# Altium schematic sheet 18_Type_C.SchDoc
size 420 x 297 mm
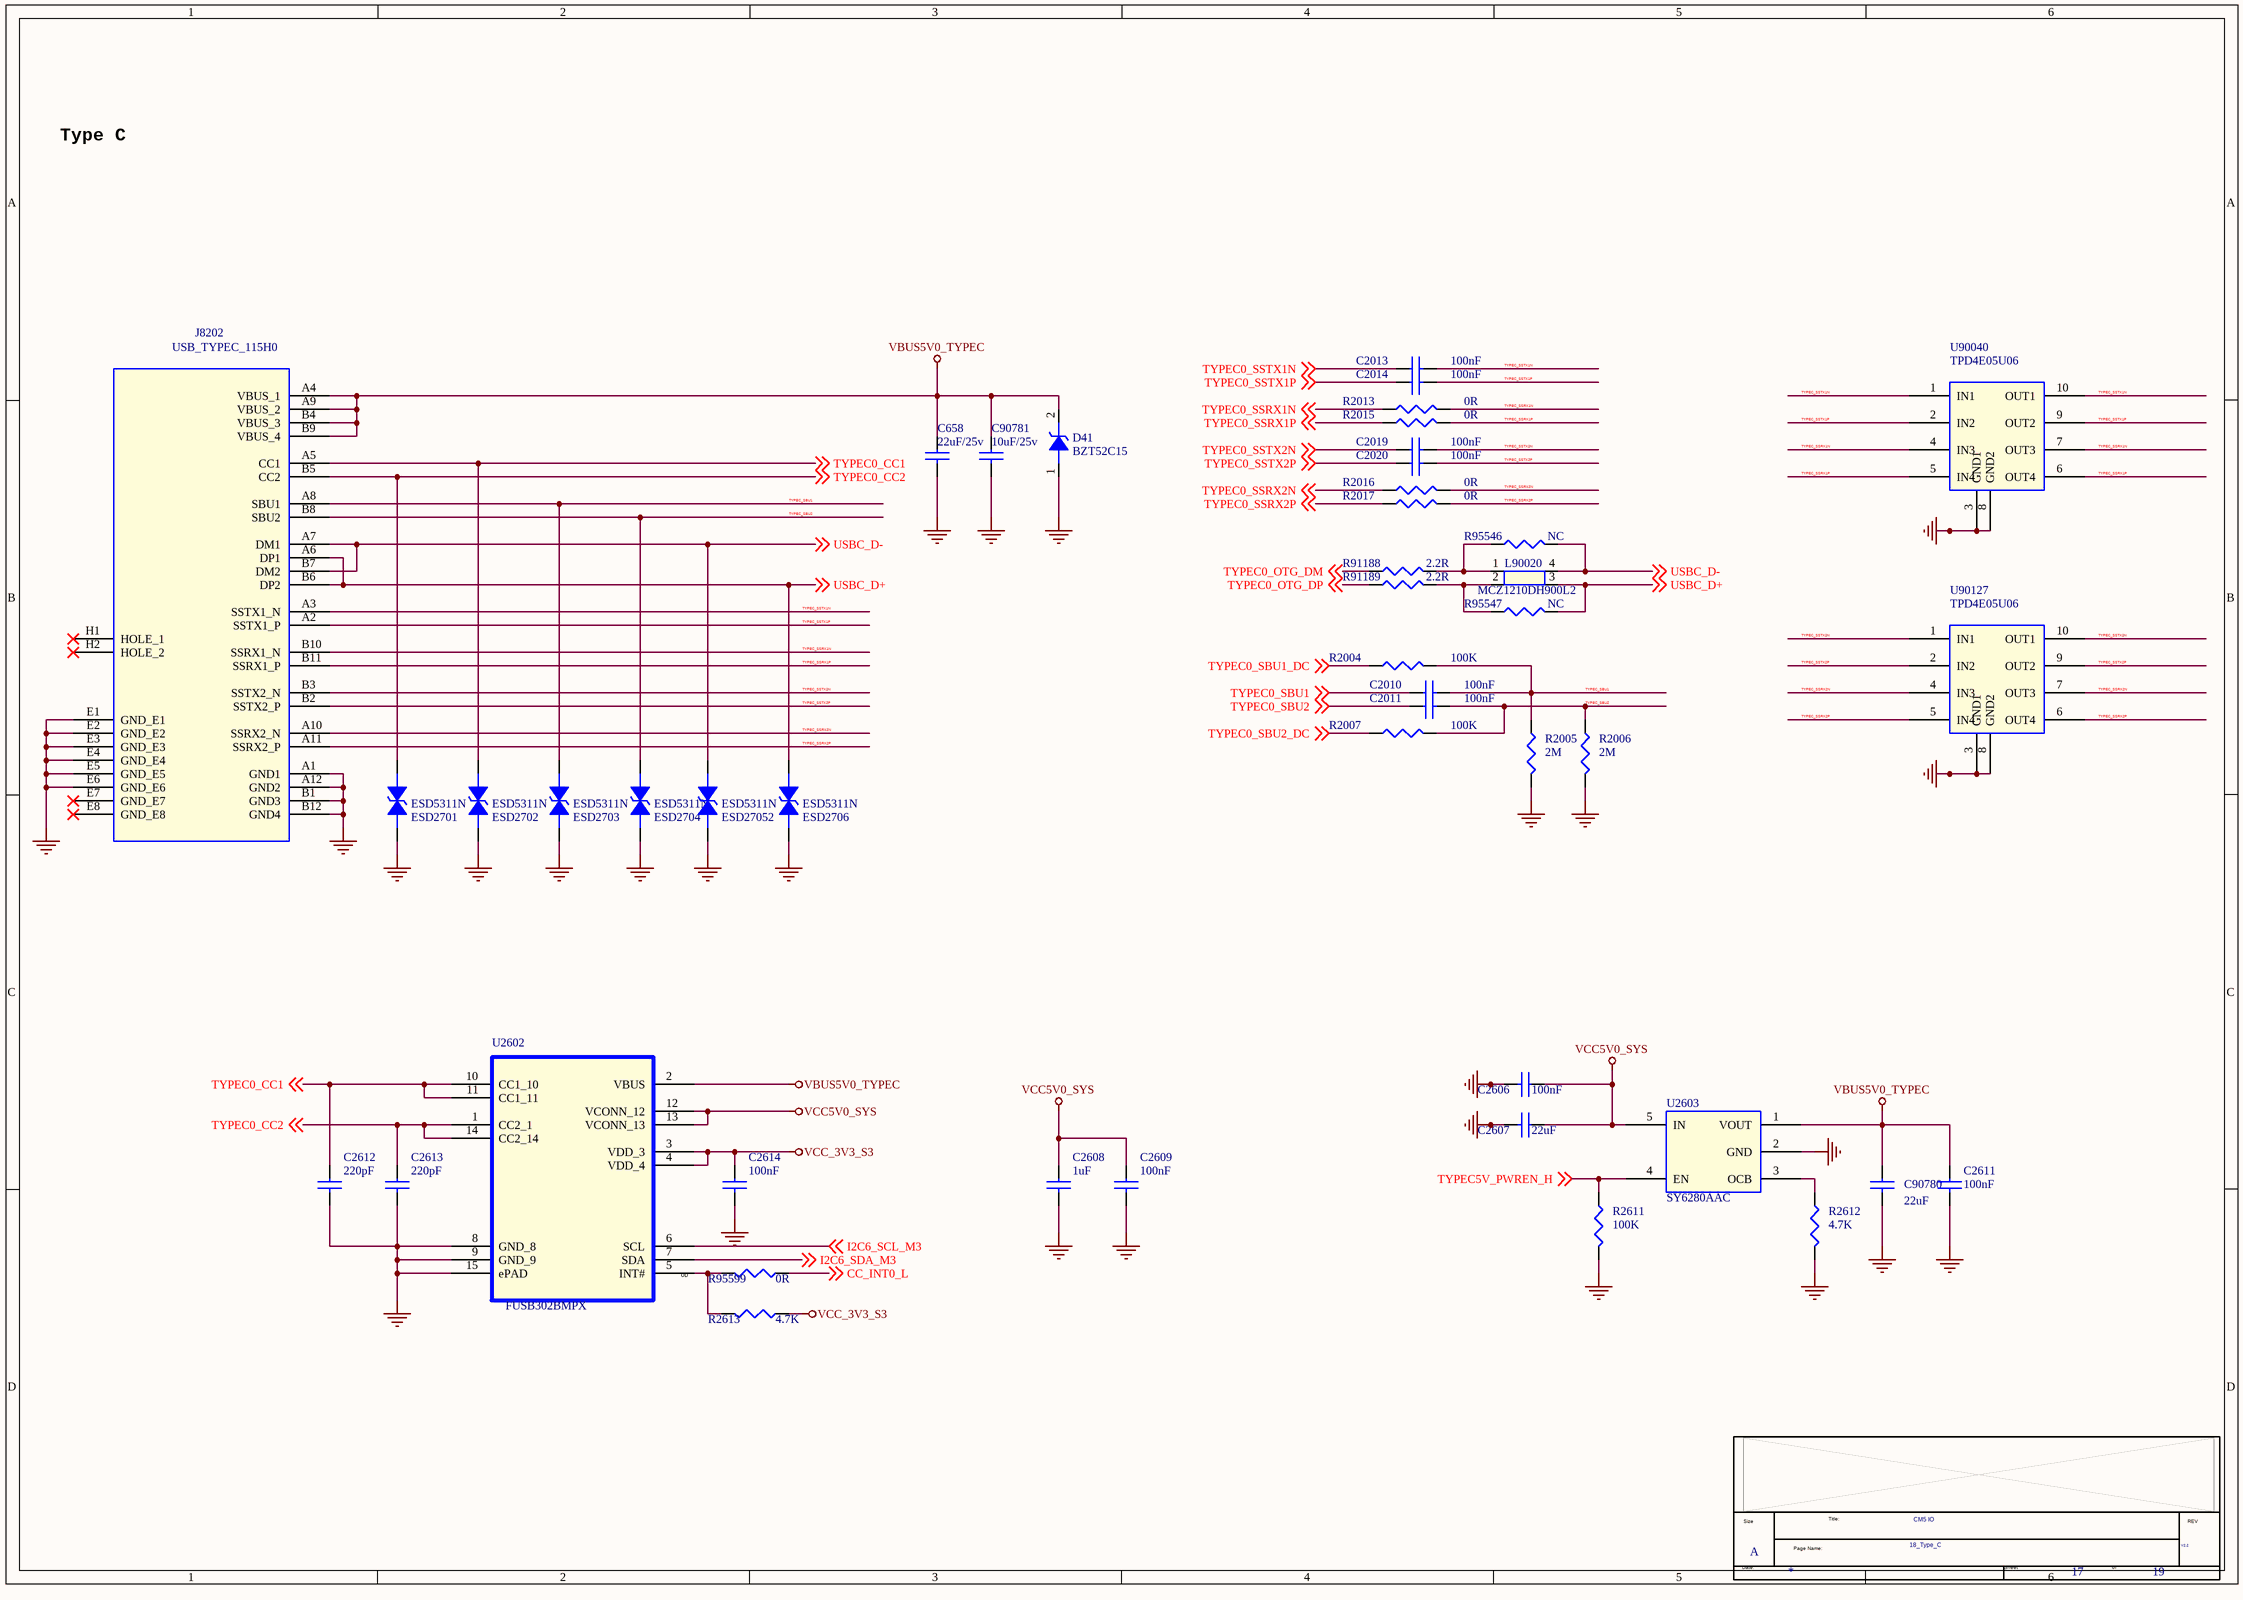
[diagram p0: 18_Type_C.SchDoc]

## Parts
*  Doc: 18_Type_C  RevCode: V2.2  Title: CM5 IO  Page Size: A  Page Number: 17  Page Count: 19  (hidden comment: radxa_1010)  (graphical)
C658  22uF/25v  [C0201]
C2010  100nF  [C0201]
C2011  100nF  [C0201]
C2013  100nF  [C0201]
C2014  100nF  [C0201]
C2019  100nF  [C0201]
C2020  100nF  [C0201]
C2606  100nF  [C0402]
C2607  22uF  [C0603]
C2608  1uF  [C0402]
C2609  100nF  [C0402]
C2611  100nF  [C0402]
C2612  220pF  [C0402]
C2613  220pF  [C0402]
C2614  100nF  [C0402]
C90780  22uF  [C0805]
C90781  10uF/25v  [C0201]
D41  BZT52C15  [SOD_123]
ESD2701  ESD5311N  [ESD0402]
ESD2702  ESD5311N  [ESD0402]
ESD2703  ESD5311N  [ESD0402]
ESD2704  ESD5311N  [ESD0402]
ESD2706  ESD5311N  [ESD0402]
ESD27052  ESD5311N  [ESD0402]
J8202  USB_TYPEC_115H0  [TYPEC-24PIN-SMD-OK]
L90020  MCZ1210DH900L2  [MCZ1210AH900L2]
R2004  100K  [R0402]
R2005  2M  [R0402]
R2006  2M  [R0402]
R2007  100K  [R0402]
R2013  0R  [R0402]
R2015  0R  [R0402]
R2016  0R  [R0402]
R2017  0R  [R0402]
R2611  100K  [R0402]
R2612  4.7K  [R0402]
R2613  4.7K  [R0402]
R91188  2.2R  [R0402]
R91189  2.2R  [R0402]
R95546  NC  [R0402]
R95547  NC  [R0402]
R95599  0R  [R0402]
U2602  FUSB302BMPX  [MLP14_2R50X2R50X0R80]
U2603  SY6280AAC  [SOT_23_5]
U90040  TPD4E05U06  [SON10_2R50X1R00X0R50]
U90127  TPD4E05U06  [SON10_2R50X1R00X0R50]

## Nets
GND: C658.2 C2606.2 C2607.2 C2608.2 C2609.2 C2611.2 C2612.2 C2613.2 C2614.2 C90780.2 C90781.2 D41.1(ANODE) ESD2701.2 ESD2702.2 ESD2703.2 ESD2704.2 ESD2706.2 ESD27052.2 J8202.A1(GND1) J8202.A12(GND2) J8202.B1(GND3) J8202.B12(GND4) J8202.E1(GND_E1) J8202.E2(GND_E2) J8202.E3(GND_E3) J8202.E4(GND_E4) J8202.E5(GND_E5) J8202.E6(GND_E6) R2005.2 R2006.2 R2611.2 R2612.2 U2602.8(GND_8) U2602.9(GND_9) U2602.15(ePAD) U2603.2(GND) U90040.3(GND1) U90040.8(GND2) U90127.3(GND1) U90127.8(GND2)
VBUS5V0_TYPEC: C658.1 C2611.1 C90780.1 C90781.1 D41.2(CATHODE) J8202.A4(VBUS_1) J8202.A9(VBUS_2) J8202.B4(VBUS_3) J8202.B9(VBUS_4) U2602.2(VBUS) U2603.1(VOUT)
VCC5V0_SYS: C2606.1 C2607.1 C2608.1 C2609.1 U2602.12(VCONN_12) U2602.13(VCONN_13) U2603.5(IN)
VCC_3V3_S3: C2614.1 R2613.1 U2602.3(VDD_3) U2602.4(VDD_4)
CC_INT0_L: R95599.1 ; off-sheet CC_INT0_L
I2C6_SCL_M3: U2602.6(SCL) ; off-sheet I2C6_SCL_M3
I2C6_SDA_M3: U2602.7(SDA) ; off-sheet I2C6_SDA_M3
TYPEC0_CC1: C2612.1 ESD2702.1 J8202.A5(CC1) U2602.10(CC1_10) U2602.11(CC1_11) ; off-sheet TYPEC0_CC1
TYPEC0_CC2: C2613.1 ESD2701.1 J8202.B5(CC2) U2602.1(CC2_1) U2602.14(CC2_14) ; off-sheet TYPEC0_CC2
TYPEC0_OTG_DM: R91188.1 ; off-sheet TYPEC0_OTG_DM
TYPEC0_OTG_DP: R91189.1 ; off-sheet TYPEC0_OTG_DP
TYPEC0_SBU1: C2010.1 ; off-sheet TYPEC0_SBU1
TYPEC0_SBU1_DC: R2004.1 ; off-sheet TYPEC0_SBU1_DC
TYPEC0_SBU2: C2011.1 ; off-sheet TYPEC0_SBU2
TYPEC0_SBU2_DC: R2007.1 ; off-sheet TYPEC0_SBU2_DC
TYPEC0_SSRX1N: R2013.1 ; off-sheet TYPEC0_SSRX1N
TYPEC0_SSRX1P: R2015.1 ; off-sheet TYPEC0_SSRX1P
TYPEC0_SSRX2N: R2016.1 ; off-sheet TYPEC0_SSRX2N
TYPEC0_SSRX2P: R2017.1 ; off-sheet TYPEC0_SSRX2P
TYPEC0_SSTX1N: C2013.1 ; off-sheet TYPEC0_SSTX1N
TYPEC0_SSTX1P: C2014.1 ; off-sheet TYPEC0_SSTX1P
TYPEC0_SSTX2N: C2019.1 ; off-sheet TYPEC0_SSTX2N
TYPEC0_SSTX2P: C2020.1 ; off-sheet TYPEC0_SSTX2P
TYPEC5V_PWREN_H: R2611.1 U2603.4(EN) ; off-sheet TYPEC5V_PWREN_H
TYPEC_SBU1: C2010.2 ESD2703.1 J8202.A8(SBU1) R2004.2 R2005.1
TYPEC_SBU2: C2011.2 ESD2704.1 J8202.B8(SBU2) R2006.1 R2007.2
TYPEC_SSRX1N: J8202.B10(SSRX1_N) R2013.2 U90040.4(IN3) U90040.7(OUT3)
TYPEC_SSRX1P: J8202.B11(SSRX1_P) R2015.2 U90040.5(IN4) U90040.6(OUT4)
TYPEC_SSRX2N: J8202.A10(SSRX2_N) R2016.2 U90127.4(IN3) U90127.7(OUT3)
TYPEC_SSRX2P: J8202.A11(SSRX2_P) R2017.2 U90127.5(IN4) U90127.6(OUT4)
TYPEC_SSTX1N: C2013.2 J8202.A3(SSTX1_N) U90040.1(IN1) U90040.10(OUT1)
TYPEC_SSTX1P: C2014.2 J8202.A2(SSTX1_P) U90040.2(IN2) U90040.9(OUT2)
TYPEC_SSTX2N: C2019.2 J8202.B3(SSTX2_N) U90127.1(IN1) U90127.10(OUT1)
TYPEC_SSTX2P: C2020.2 J8202.B2(SSTX2_P) U90127.2(IN2) U90127.9(OUT2)
USBC_D+: ESD2706.1 J8202.A6(DP1) J8202.B6(DP2) L90020.3 R95547.2 ; off-sheet USBC_D+
USBC_D-: ESD27052.1 J8202.A7(DM1) J8202.B7(DM2) L90020.4 R95546.2 ; off-sheet USBC_D-
NetL90020_1: L90020.1 R91188.2 R95546.1
NetL90020_2: L90020.2 R91189.2 R95547.1
NetR2612_1: R2612.1 U2603.3(OCB)
NetR2613_2: R2613.2 R95599.2 U2602.5(INT#)

Not connected (* = marked no-connect by the designer): J8202 E7(GND_E7)* E8(GND_E8)* H1(HOLE_1)* H2(HOLE_2)*

## Notes on the sheet
- Type C
- (near U2602) OD
- (in symbol radxa_1010) Size; Title:; REV; Page Name:; Date:; Sheet; of

## Library data of the parts
C658 = C / 100 / nF / 0201_6: 0201 ∮ 10% 100nf X5R 6.3V; FS: Y; Property1: ∮ 10%; FPLIST: C0201,M0201; FunctionGroup: Petrus / BB; PCB Footprint: C0805; Property3: 6.3V; Property2: X5R
C2010 C2011 C2013 C2014 C2019 C2020 = CAP NP_0: cap,100.00nF,+/-10%,10V,X5R,C0201; Manufacturer: TDK; RK PN: C0603X5R1A104K030BC; Priority: A; Tolerance: 10%; Voltage: 10V; PCB Footprint: C0201; Dielectric: X5R; Part Type: C0201; Manufacturer PN: C0603X5R1A104K030BC; Created by: JJJ
C2606 = CAP NP_0: cap,100.00nF,+/-10%,16V,X5R,C0402; Manufacturer PN: C1005X5R1C104K050BA; Manufacturer: TDK; Tolerance: 10%; C_Voltage: 6.3V; Priority: A; Voltage: 16V; PCB Footprint: C0402; Dielectric: X5R; Created by: JJJ; Part Type: C0402; RK PN: C1005X5R1C104K050BA
C2607 = CAP NP_0: cap,22.00uF,+/-20%,10V,X5R,C0603; Manufacturer PN: C1608X5R1A226M080AC; Manufacturer: TDK; Tolerance: 20%; C_Voltage: 6.3V; Priority: A; Voltage: 10V; PCB Footprint: C0603; Dielectric: X5R; Created by: JJJ; Part Type: C0603; RK PN: C1608X5R1A226M080AC
C2608 = CAP NP_0: cap,1.00uF,+/-10%,16V,X5R,C0402; Manufacturer: TDK; RK PN: C1005X5R1C105K050BC; Priority: A; Tolerance: 10%; Voltage: 16V; PCB Footprint: C0402; Dielectric: X5R; Part Type: C0402; Manufacturer PN: C1005X5R1C105K050BC; Created by: JJJ
C2609 = CAP NP_0: cap,100.00nF,+/-10%,16V,X5R,C0402; Manufacturer PN: C1005X5R1C104K050BA; Manufacturer: TDK; Tolerance: 10%; Priority: A; Voltage: 16V; PCB Footprint: C0402; Dielectric: X5R; Created by: JJJ; Part Type: C0402; RK PN: C1005X5R1C104K050BA
C2611 = CAP NP_0: cap,100.00nF,+/-10%,16V,X5R,C0402; Manufacturer: TDK; Voltage: 25V; RK PN: C1005X5R1C104K050BA; Priority: A; Tolerance: 10%; PCB Footprint: C0402; Dielectric: X5R; Part Type: C0402; Manufacturer PN: C1005X5R1C104K050BA; Created by: JJJ
C2612 = CAP NP_0: cap,220.00pF,+/-5%,50V,C0G,C0402; Manufacturer PN: C1005C0G1H221J050BA; Manufacturer: TDK; Tolerance: 5%; Priority: A; Voltage: 50V; PCB Footprint: C0402; Dielectric: C0G; Created by: JJJ; Part Type: C0402; RK PN: C1005C0G1H221J050BA
C2613 = CAP NP_0: cap,220.00pF,+/-5%,50V,C0G,C0402; Manufacturer: TDK; RK PN: C1005C0G1H221J050BA; Priority: A; Tolerance: 5%; Voltage: 50V; PCB Footprint: C0402; Dielectric: C0G; Part Type: C0402; Manufacturer PN: C1005C0G1H221J050BA; Created by: JJJ
C2614 = CAP NP_0: cap,100.00nF,+/-10%,16V,X5R,C0402; Manufacturer: TDK; RK PN: C1005X5R1C104K050BA; Priority: A; Tolerance: 10%; Voltage: 16V; PCB Footprint: C0402; Dielectric: X5R; Part Type: C0402; Manufacturer PN: C1005X5R1C104K050BA; Created by: JJJ
C90780 = CAP NP_0: cap,22.00uF,+/-20%,10V,X5R,C0603; Manufacturer: TDK; Voltage: 25V; RK PN: C1608X5R1A226M080AC; Priority: A; C_Voltage: 6.3V; Tolerance: 20%; PCB Footprint: C0805; Dielectric: X5R; Part Type: C0603; Manufacturer PN: C1608X5R1A226M080AC; Created by: JJJ
C90781 = C / 100 / nF / 0201_6: 0201 ∮ 10% 100nf X5R 6.3V; FunctionGroup: Petrus / BB; FPLIST: C0201,M0201; Property1: ∮ 10%; FS: Y; PCB Footprint: C0805; Property2: X5R; Property3: 6.3V
D41 = DIODE ZENER1_0: ZENER DIODE,Vz=3.3V,BZT52C3V3,SOD-123; Manufacturer: 长电; Priority: A; PCB Footprint: SOD_123; RK PN: BZT52C3V3; Part Type: Zener Diodes; Manufacturer PN: BZT52C3V3; Created by: JJJ
ESD2701 = DIODE BI_DIR TRIG_1_Dup1: 1-Line, Bi-directional, Transient Voltage Suppressors.1pF.; Manufacturer: WillSemi(韦尔半导体); Manufacturer PN: ESD5341N; Priority: A; PCB Footprint: ESD0402; Created by: JJJ; Part Type: ESD_TVS; RK PN: ESD5341N
ESD2702-ESD2704 ESD2706 ESD27052 = DIODE BI_DIR TRIG_1_Dup1: 1-Line, Bi-directional, Transient Voltage Suppressors.1pF.; Manufacturer: WillSemi(韦尔半导体); RK PN: ESD5341N; Priority: A; PCB Footprint: ESD0402; Part Type: ESD_TVS; Manufacturer PN: ESD5341N; Created by: JJJ
J8202 = USB31_TYPE_C: USB Type-C 连接座; Manufacturer: 泰科; Priority: A; PCB Footprint: TYPEC-24PIN-SMD-OK; RK PN: USB_TYPEC_115H0; Part Type: USB Jack; Manufacturer Part Number: USB_TYPEC_115H0; Created by: JJJ
L90020 = MCZ1210AH900L2_1_Dup1: PCB Footprint: MCZ1210AH900L2
R2004 = RESISTOR_1: 通用厚膜电阻,100K,+/-5%,R0201,1/20W.; Manufacturer: YAGEO; Tolerance: 5%; RK PN: RC0201JR-07100KL; Priority: A; Wattage: 1/20W; PCB Footprint: R0201; Part Type: 通用厚膜电阻; Manufacturer PN: RC0201JR-07100KL; Created by: YTL
R2005 = RESISTOR_1: 通用厚膜电阻,2M,+/-5%,R0201,1/20W.; Manufacturer PN: RC0201JR-072ML; Manufacturer: YAGEO; Tolerance: 5%; OPTION: DNP; Wattage: 1/20W; Priority: A; PCB Footprint: R0201; Created by: YTL; Part Type: 通用厚膜电阻; RK PN: RC0201JR-072ML
R2006 = RESISTOR_1: 通用厚膜电阻,2M,+/-5%,R0201,1/20W.; Manufacturer: YAGEO; Tolerance: 5%; OPTION: DNP; RK PN: RC0201JR-072ML; Priority: A; Wattage: 1/20W; PCB Footprint: R0201; Part Type: 通用厚膜电阻; Manufacturer PN: RC0201JR-072ML; Created by: YTL
R2007 = RESISTOR_1: 通用厚膜电阻,100K,+/-5%,R0201,1/20W.; Manufacturer PN: RC0201JR-07100KL; Manufacturer: YAGEO; Tolerance: 5%; Wattage: 1/20W; Priority: A; PCB Footprint: R0201; Created by: YTL; Part Type: 通用厚膜电阻; RK PN: RC0201JR-07100KL
R2013 R2015 R2016 = RESISTOR_1: 通用厚膜电阻,0R,+/-5%,R0201,1/20W.; Manufacturer PN: RC0201JR-070RL; Manufacturer: YAGEO; Tolerance: 5%; Wattage: 1/20W; Priority: A; PCB Footprint: R0201; Created by: YTL; Part Type: 通用厚膜电阻; RK PN: RC0201JR-070RL
R2017 = RESISTOR_1: 通用厚膜电阻,0R,+/-5%,R0201,1/20W.; Manufacturer: YAGEO; Tolerance: 5%; RK PN: RC0201JR-070RL; Priority: A; Wattage: 1/20W; PCB Footprint: R0201; Part Type: 通用厚膜电阻; Manufacturer PN: RC0201JR-070RL; Created by: YTL
R2611 = RESISTOR_1: 通用厚膜电阻,100K,+/-5%,R0402,1/16W.; Manufacturer: YAGEO; Tolerance: 5%; RK PN: RC0402JR-07100KL; Priority: A; Wattage: 1/16W; PCB Footprint: R0402; Part Type: 通用厚膜电阻; Manufacturer PN: RC0402JR-07100KL; Created by: YTL
R2612 = RESISTOR_1: 通用厚膜电阻,4K7,+/-5%,R0402,1/16W.; Manufacturer: YAGEO; Tolerance: 5%; RK PN: RC0402JR-074K7L; Priority: A; Wattage: 1/16W; PCB Footprint: R0402; Part Type: 通用厚膜电阻; Manufacturer PN: RC0402JR-074K7L; Created by: YTL
R2613 = RESISTOR_1: 通用厚膜电阻,10K,+/-5%,R0402,1/16W.; Manufacturer: YAGEO; Tolerance: 5%; RK PN: RC0402JR-0710KL; Priority: A; Wattage: 1/16W; PCB Footprint: R0402; Part Type: 通用厚膜电阻; Manufacturer PN: RC0402JR-0710KL; Created by: YTL
R91188 = RESISTOR_0_Dup1: 通用厚膜电阻,2R2,+/-5%,R0402,1/16W.; Manufacturer PN: RC0402JR-072R2L; Manufacturer: YAGEO; Tolerance: 5%; Wattage: 1/16W; Priority: A; PCB Footprint: R0402; Created by: YTL; Part Type: 通用厚膜电阻; RK PN: RC0402JR-072R2L
R91189 R95546 R95547 = RESISTOR_0_Dup1: 通用厚膜电阻,2R2,+/-5%,R0402,1/16W.; Manufacturer: YAGEO; Tolerance: 5%; RK PN: RC0402JR-072R2L; Priority: A; Wattage: 1/16W; PCB Footprint: R0402; Part Type: 通用厚膜电阻; Manufacturer PN: RC0402JR-072R2L; Created by: YTL
R95599 = RESISTOR_1: 通用厚膜电阻,10K,+/-5%,R0402,1/16W.; Manufacturer PN: RC0402JR-0710KL; Manufacturer: YAGEO; Tolerance: 5%; Wattage: 1/16W; Priority: A; PCB Footprint: R0402; Created by: YTL; Part Type: 通用厚膜电阻; RK PN: RC0402JR-0710KL
U2602 = USB_FUSB302B: Programmable USB Type-C Controller w/PD; Manufacturer: Fairchild(飞兆半导体); Priority: A; PCB Footprint: MLP14_2R50X2R50X0R80; RK PN: FUSB302BMPX; Part Type: USB; Manufacturer PN: FUSB302BMPX; Created by: JJJ
U2603 = SWITCH_SY6280: Low Loss Power Distribution Switch; Manufacturer: Silergy（矽力杰）; Priority: A; PCB Footprint: SOT_23_5; RK PN: SY6280AAC; Part Type: Switch; Manufacturer PN: SY6280AAC; Created by: JJJ
U90040 U90127 = ESD_TPD4E05U06: unidirectional ESD protection devices with ultra low capacitance; Manufacturer: TI（德州仪器）; Priority: A; PCB Footprint: SON10_2R50X1R00X0R50; Created by: JJJ; Manufacturer PN: TPD4E05U06; Part Type: ESD_TVS; RK PN: TPD4E05U06
* = radxa_1010: Page Create Date: March  8, 1995; Page Modify Date: *